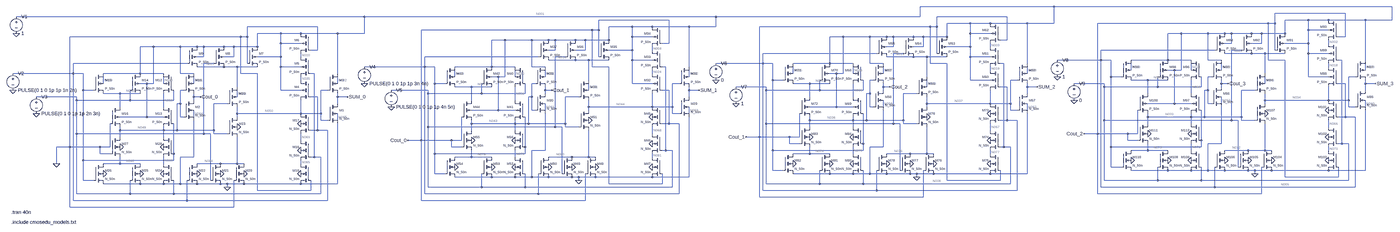
[diagram p0: schematic RIPPLE_CARRY_ADDER_50n.asc, whole sheet]
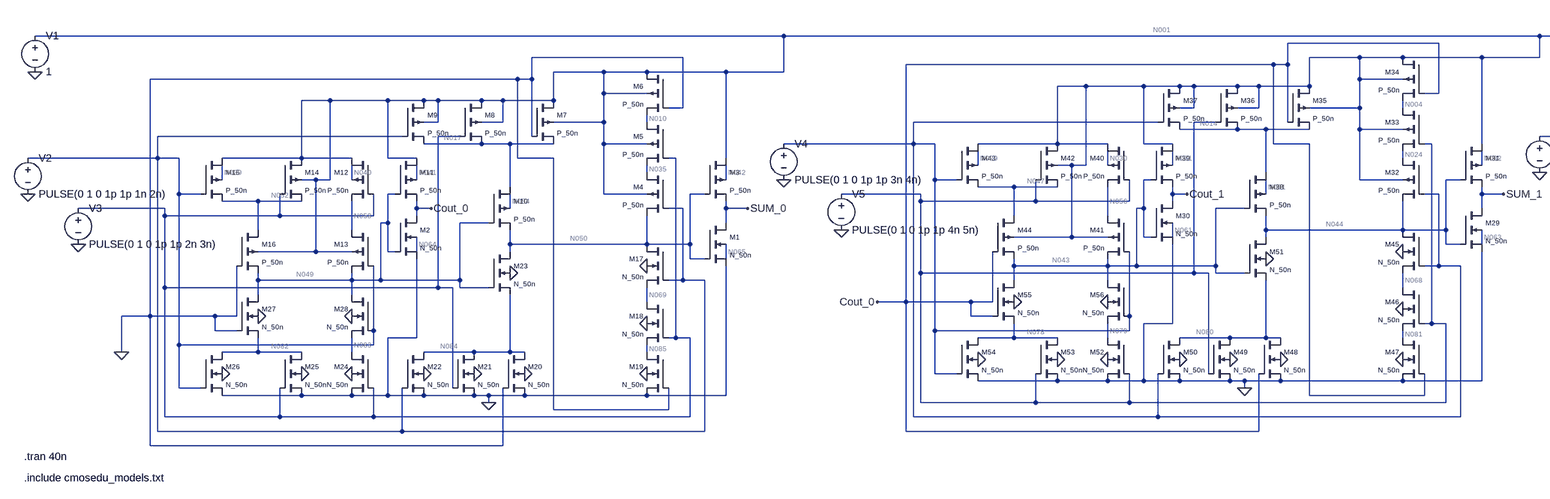
[diagram p1: schematic RIPPLE_CARRY_ADDER_50n.asc, part, row 1 of 1, column 1 of 2]
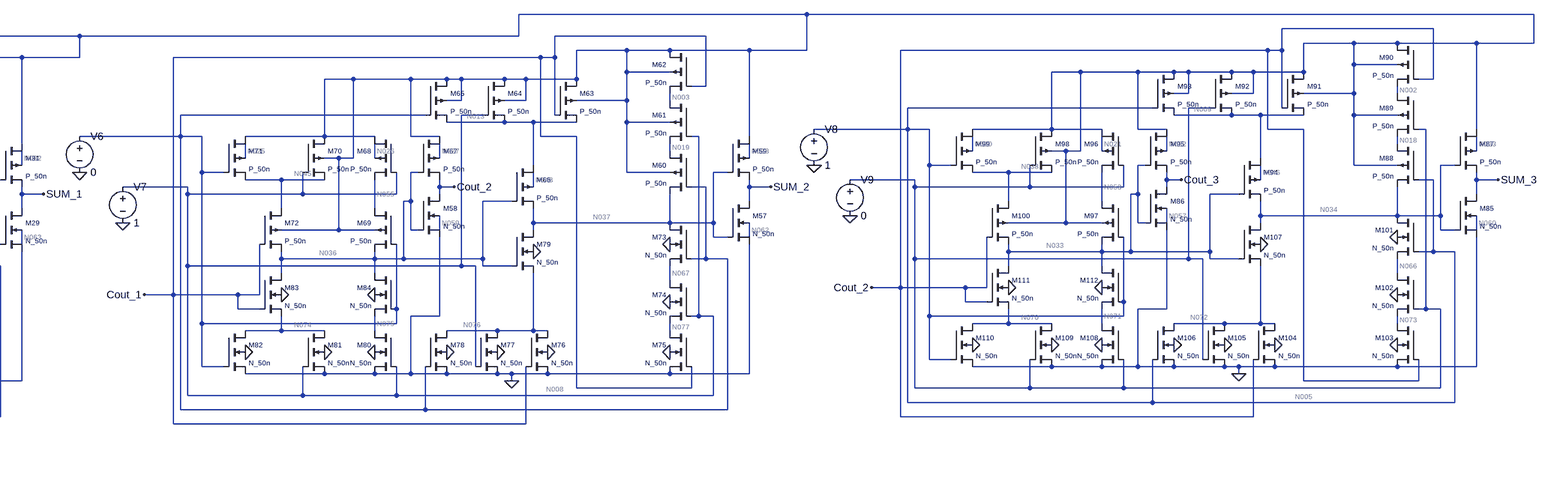
[diagram p2: schematic RIPPLE_CARRY_ADDER_50n.asc, part, row 1 of 1, column 2 of 2]
* RIPPLE_CARRY_ADDER_50n.asc
M1 SUM_0 N050 0 N065 N_50n l=50n w=2000n
M2 Cout_0 N049 0 N064 N_50n l=50n w=1000n
M3 N001 N050 SUM_0 N042 P_50n l=50n w=5000n
M4 N035 N015 N050 N001 P_50n l=50n w=1000n
M5 N010 N016 N035 N001 P_50n l=50n w=1000n
M6 N001 0 N010 N001 P_50n l=50n w=1000n
M7 N001 0 N017 N001 P_50n l=50n w=1000n
M8 N001 N016 N017 N001 P_50n l=50n w=1000n
M9 N001 N015 N017 N001 P_50n l=50n w=1000n
M10 N017 N049 N050 N054 P_50n l=50n w=1000n
M11 N001 N049 Cout_0 N041 P_50n l=50n w=1000n
M12 N001 N016 N058 N040 P_50n l=50n w=1000n
M13 N058 N015 N049 N001 P_50n l=50n w=1000n
M14 N001 N016 N052 N001 P_50n l=50n w=1000n
M15 N001 N015 N052 N039 P_50n l=50n w=1000n
M16 N052 0 N049 N001 P_50n l=50n w=1000n
M17 N050 N015 N069 0 N_50n l=50n w=500n
M18 N069 N016 N085 0 N_50n l=50n w=500n
M19 N085 0 0 0 N_50n l=50n w=500n
M20 N084 0 0 0 N_50n l=50n w=500n
M21 N084 N016 0 0 N_50n l=50n w=500n
M22 N084 N015 0 0 N_50n l=50n w=500n
M23 N050 N049 N084 0 N_50n l=50n w=500n
M24 N083 N016 0 0 N_50n l=50n w=500n
M25 N082 N016 0 0 N_50n l=50n w=500n
M26 N082 N015 0 0 N_50n l=50n w=500n
M27 N049 0 N082 0 N_50n l=50n w=500n
M28 N049 N015 N083 0 N_50n l=50n w=500n
M29 SUM_1 N044 0 N063 N_50n l=50n w=2000n
M30 Cout_1 N043 0 N061 N_50n l=50n w=1000n
M31 N001 N044 SUM_1 N032 P_50n l=50n w=5000n
M32 N024 N011 N044 N001 P_50n l=50n w=5000n
M33 N004 N012 N024 N001 P_50n l=50n w=5000n
M34 N001 Cout_0 N004 N001 P_50n l=50n w=5000n
M35 N001 Cout_0 N014 N001 P_50n l=50n w=5000n
M36 N001 N012 N014 N001 P_50n l=50n w=5000n
M37 N001 N011 N014 N001 P_50n l=50n w=5000n
M38 N014 N043 N044 N051 P_50n l=50n w=5000n
M39 N001 N043 Cout_1 N031 P_50n l=50n w=1000n
M40 N001 N012 N056 N030 P_50n l=50n w=1000n
M41 N056 N011 N043 N001 P_50n l=50n w=1000n
M42 N001 N012 N047 N001 P_50n l=50n w=1000n
M43 N001 N011 N047 N029 P_50n l=50n w=1000n
M44 N047 Cout_0 N043 N001 P_50n l=50n w=5000n
M45 N044 N011 N068 0 N_50n l=50n w=2000n
M46 N068 N012 N081 0 N_50n l=50n w=2000n
M47 N081 Cout_0 0 0 N_50n l=50n w=2000n
M48 N080 Cout_0 0 0 N_50n l=50n w=2000n
M49 N080 N012 0 0 N_50n l=50n w=2000n
M50 N080 N011 0 0 N_50n l=50n w=2000n
M51 N044 N043 N080 0 N_50n l=50n w=2000n
M52 N079 N012 0 0 N_50n l=50n w=500n
M53 N078 N012 0 0 N_50n l=50n w=500n
M54 N078 N011 0 0 N_50n l=50n w=500n
M55 N043 Cout_0 N078 0 N_50n l=50n w=2000n
M56 N043 N011 N079 0 N_50n l=50n w=500n
M57 SUM_2 N037 0 N062 N_50n l=50n w=500n
M58 Cout_2 N036 0 N059 N_50n l=50n w=1000n
M59 N001 N037 SUM_2 N028 P_50n l=50n w=1000n
M60 N019 N007 N037 N001 P_50n l=50n w=1000n
M61 N003 N008 N019 N001 P_50n l=50n w=1000n
M62 N001 Cout_1 N003 N001 P_50n l=50n w=1000n
M63 N001 Cout_1 N013 N001 P_50n l=50n w=1000n
M64 N001 N008 N013 N001 P_50n l=50n w=1000n
M65 N001 N007 N013 N001 P_50n l=50n w=1000n
M66 N013 N036 N037 N048 P_50n l=50n w=1000n
M67 N001 N036 Cout_2 N027 P_50n l=50n w=1000n
M68 N001 N008 N055 N026 P_50n l=50n w=1000n
M69 N055 N007 N036 N001 P_50n l=50n w=1000n
M70 N001 N008 N045 N001 P_50n l=50n w=1000n
M71 N001 N007 N045 N025 P_50n l=50n w=1000n
M72 N045 Cout_1 N036 N001 P_50n l=50n w=5000n
M73 N037 N007 N067 0 N_50n l=50n w=500n
M74 N067 N008 N077 0 N_50n l=50n w=500n
M75 N077 Cout_1 0 0 N_50n l=50n w=500n
M76 N076 Cout_1 0 0 N_50n l=50n w=500n
M77 N076 N008 0 0 N_50n l=50n w=500n
M78 N076 N007 0 0 N_50n l=50n w=500n
M79 N037 N036 N076 0 N_50n l=50n w=500n
M80 N075 N008 0 0 N_50n l=50n w=500n
M81 N074 N008 0 0 N_50n l=50n w=500n
M82 N074 N007 0 0 N_50n l=50n w=500n
M83 N036 Cout_1 N074 0 N_50n l=50n w=2000n
M84 N036 N007 N075 0 N_50n l=50n w=500n
M85 SUM_3 N034 0 N060 N_50n l=50n w=2000n
M86 Cout_3 N033 0 N057 N_50n l=50n w=1000n
M87 N001 N034 SUM_3 N023 P_50n l=50n w=5000n
M88 N018 N005 N034 N001 P_50n l=50n w=1000n
M89 N002 N006 N018 N001 P_50n l=50n w=1000n
M90 N001 Cout_2 N002 N001 P_50n l=50n w=1000n
M91 N001 Cout_2 N009 N001 P_50n l=50n w=1000n
M92 N001 N006 N009 N001 P_50n l=50n w=1000n
M93 N001 N005 N009 N001 P_50n l=50n w=1000n
M94 N009 N033 N034 N046 P_50n l=50n w=1000n
M95 N001 N033 Cout_3 N022 P_50n l=50n w=1000n
M96 N001 N006 N053 N021 P_50n l=50n w=1000n
M97 N053 N005 N033 N001 P_50n l=50n w=1000n
M98 N001 N006 N038 N001 P_50n l=50n w=1000n
M99 N001 N005 N038 N020 P_50n l=50n w=1000n
M100 N038 Cout_2 N033 N001 P_50n l=50n w=1000n
M101 N034 N005 N066 0 N_50n l=50n w=500n
M102 N066 N006 N073 0 N_50n l=50n w=500n
M103 N073 Cout_2 0 0 N_50n l=50n w=500n
M104 N072 Cout_2 0 0 N_50n l=50n w=500n
M105 N072 N006 0 0 N_50n l=50n w=500n
M106 N072 N005 0 0 N_50n l=50n w=500n
M107 N034 N033 N072 0 N_50n l=50n w=500n
M108 N071 N006 0 0 N_50n l=50n w=500n
M109 N070 N006 0 0 N_50n l=50n w=500n
M110 N070 N005 0 0 N_50n l=50n w=500n
M111 N033 Cout_2 N070 0 N_50n l=50n w=500n
M112 N033 N005 N071 0 N_50n l=50n w=500n
V1 N001 0 1
V2 N015 0 PULSE(0 1 0 1p 1p 1n 2n)
V3 N016 0 PULSE(0 1 0 1p 1p 2n 3n)
V4 N011 0 PULSE(0 1 0 1p 1p 3n 4n)
V5 N012 0 PULSE(0 1 0 1p 1p 4n 5n)
V6 N007 0 0
V7 N008 0 1
V8 N005 0 1
V9 N006 0 0
.model NMOS NMOS
.model PMOS PMOS
.lib standard.mos
.include cmosedu_models.txt
.tran 40n
.backanno
.end

* Results of the author's LTspice run, read from the files saved beside the schematic
* Operating Point, zero values left out:
*   V(sum_0) = 35.28 µV
*   V(n050) = 999.6 mV
*   V(n065) = 304.2 mV
*   V(cout_0) = 148.5 µV
*   V(n049) = 999.9 mV
*   V(n064) = 303.9 mV
*   V(n001) = 1 V
*   V(n042) = 797.2 mV
*   V(n035) = 999.7 mV
*   V(n010) = 999.8 mV
*   V(n017) = 1 V
*   V(n054) = 804.7 mV
*   V(n041) = 758 mV
*   V(n058) = 1 V
*   V(n040) = 675.1 mV
*   V(n052) = 1 V
*   V(n039) = 675.1 mV
*   V(n069) = 53.61 mV
*   V(n085) = 15.95 mV
*   V(n084) = 859.3 mV
*   V(n083) = 38.1 mV
*   V(n082) = 24.83 mV
*   V(sum_1) = 35.18 µV
*   V(n044) = 999.8 mV
*   V(n063) = 304.3 mV
*   V(cout_1) = 78.12 µV
*   V(n043) = 999.9 mV
*   V(n061) = 303.9 mV
*   V(n032) = 797.2 mV
*   V(n024) = 999.9 mV
*   V(n004) = 999.9 mV
*   V(n014) = 1 V
*   V(n051) = 840.5 mV
*   V(n031) = 758 mV
*   V(n056) = 999.9 mV
*   V(n030) = 675.1 mV
*   V(n047) = 999.9 mV
*   V(n029) = 675.1 mV
*   V(n068) = 53.57 mV
*   V(n081) = 15.9 mV
*   V(n080) = 859.2 mV
*   V(n079) = 38.1 mV
*   V(n078) = 54.62 mV
*   V(sum_2) = 1 V
*   V(n037) = 130.7 µV
*   V(n062) = 224.7 mV
*   V(cout_2) = 42.39 µV
*   V(n036) = 999.8 mV
*   V(n059) = 303.8 mV
*   V(n028) = 675.2 mV
*   V(n019) = 170.9 mV
*   V(n003) = 1 V
*   V(n008) = 1 V
*   V(n013) = 1 V
*   V(n048) = 757.9 mV
*   V(n027) = 758 mV
*   V(n055) = 999.8 mV
*   V(n026) = 804.8 mV
*   V(n045) = 999.8 mV
*   V(n025) = 675.1 mV
*   V(n067) = 31.45 mV
*   V(n077) = 31.45 mV
*   V(n076) = 66.24 µV
*   V(n075) = 4.058 µV
*   V(n074) = 13.76 µV
*   V(sum_3) = 1 V
*   V(n034) = 299.4 µV
*   V(n060) = 195.2 mV
*   V(cout_3) = 16.17 µV
*   V(n033) = 999.9 mV
*   V(n057) = 303.8 mV
*   V(n023) = 675.1 mV
*   V(n018) = 999.9 mV
*   V(n005) = 1 V
*   V(n002) = 1 V
*   V(n009) = 1 V
*   V(n046) = 757.9 mV
*   V(n022) = 758 mV
*   V(n053) = 1 V
*   V(n021) = 675.1 mV
*   V(n038) = 999.9 mV
*   V(n020) = 804.9 mV
*   V(n066) = 300.3 µV
*   V(n073) = 149.6 µV
*   V(n072) = 150.6 µV
*   V(n071) = 889.7 mV
*   V(n070) = 4.062 µV
*   Id(M100) = 51.55 nA
*   Ig(M100) = -17.56 nA
*   Ib(M100) = 139 pA
*   Is(M100) = -34.14 nA
*   Id(M99) = 8.865 pA
*   Is(M99) = -8.066 pA
*   Id(M98) = 68.97 nA
*   Ig(M98) = -17.56 nA
*   Ib(M98) = 139.3 pA
*   Is(M98) = -51.54 nA
*   Id(M97) = 5.38 pA
*   Is(M97) = -5.39 pA
*   Id(M96) = 17.5 nA
*   Ig(M96) = -17.49 nA
*   Is(M96) = -5.38 pA
*   Id(M95) = 20.09 nA
*   Ig(M95) = 11.13 nA
*   Is(M95) = -31.22 nA
*   Id(M94) = 20.06 nA
*   Ig(M94) = 11.12 nA
*   Is(M94) = -31.19 nA
*   Id(M93) = 1.061 pA
*   Is(M93) = -1.063 pA
*   Id(M92) = 27.46 nA
*   Ig(M92) = -17.57 nA
*   Ib(M92) = 139.3 pA
*   Is(M92) = -10.03 nA
*   Id(M91) = 27.46 nA
*   Ig(M91) = -17.56 nA
*   Ib(M91) = 139.2 pA
*   Is(M91) = -10.03 nA
*   Id(M90) = 41.55 nA
*   Ig(M90) = -17.56 nA
*   Ib(M90) = 139.2 pA
*   Is(M90) = -24.12 nA
*   Id(M89) = 24.12 nA
*   Ig(M89) = -17.56 nA
*   Ib(M89) = 139.2 pA
*   Is(M89) = -6.699 nA
*   Id(M88) = 6.699 nA
*   Ig(M88) = 11.13 nA
*   Ib(M88) = 1 pA
*   Is(M88) = -17.83 nA
*   Id(M87) = 115 nA
*   Ig(M87) = -88.05 nA
*   Is(M87) = -26.98 nA
*   Id(M72) = 151 nA
*   Ig(M72) = -88.44 nA
*   Ib(M72) = 699.1 pA
*   Is(M72) = -63.21 nA
*   Id(M71) = 168.4 nA
*   Ig(M71) = -17.48 nA
*   Is(M71) = -150.9 nA
*   Id(M70) = 8.187 pA
*   Is(M70) = -8.2 pA
*   Id(M69) = 24.13 pA
*   Ig(M69) = -17.55 nA
*   Ib(M69) = 138.8 pA
*   Is(M69) = 17.39 nA
*   Id(M68) = 24.92 pA
*   Is(M68) = -24.13 pA
*   Id(M67) = 20.13 nA
*   Ig(M67) = 11.13 nA
*   Is(M67) = -31.26 nA
*   Id(M66) = 20.11 nA
*   Ig(M66) = 11.13 nA
*   Is(M66) = -31.24 nA
*   Id(M65) = 27.48 nA
*   Ig(M65) = -17.57 nA
*   Ib(M65) = 139.3 pA
*   Is(M65) = -10.05 nA
*   Id(M64) = 1.063 pA
*   Is(M64) = -1.064 pA
*   Id(M63) = 27.48 nA
*   Ig(M63) = -17.56 nA
*   Ib(M63) = 139.1 pA
*   Is(M63) = -10.06 nA
*   Id(M62) = 22.59 nA
*   Ig(M62) = -17.56 nA
*   Ib(M62) = 139.1 pA
*   Is(M62) = -5.164 nA
*   Id(M61) = 5.164 nA
*   Ig(M61) = 5.533 nA
*   Is(M61) = -10.7 nA
*   Id(M60) = 10.7 nA
*   Ig(M60) = -40.03 pA
*   Ib(M60) = 1.836 pA
*   Is(M60) = -10.66 nA
*   Id(M59) = 24.79 nA
*   Ig(M59) = -17.48 nA
*   Is(M59) = -7.304 nA
*   Id(M44) = 92.57 nA
*   Ig(M44) = -88.46 nA
*   Ib(M44) = 699.6 pA
*   Is(M44) = -4.807 nA
*   Id(M43) = 66.44 nA
*   Ig(M43) = -17.49 nA
*   Is(M43) = -48.95 nA
*   Id(M42) = 61.05 nA
*   Ig(M42) = -17.56 nA
*   Ib(M42) = 139.3 pA
*   Is(M42) = -43.62 nA
*   Id(M41) = 32.92 nA
*   Ig(M41) = -17.56 nA
*   Ib(M41) = 139.2 pA
*   Is(M41) = -15.5 nA
*   Id(M40) = 50.41 nA
*   Ig(M40) = -17.49 nA
*   Is(M40) = -32.92 nA
*   Id(M39) = 20.06 nA
*   Ig(M39) = 11.13 nA
*   Is(M39) = -31.19 nA
*   Id(M38) = 78.94 pA
*   Is(M38) = -78.11 pA
*   Id(M37) = 87.86 nA
*   Ig(M37) = -88.54 nA
*   Ib(M37) = 702.1 pA
*   Is(M37) = -18.53 pA
*   Id(M36) = 87.86 nA
*   Ig(M36) = -88.54 nA
*   Ib(M36) = 702.1 pA
*   Is(M36) = -18.53 pA
*   Id(M35) = 87.83 nA
*   Ig(M35) = -88.49 nA
*   Ib(M35) = 700.3 pA
*   Is(M35) = -41.89 pA
*   Id(M34) = 367.3 nA
*   Ig(M34) = -88.48 nA
*   Ib(M34) = 700.3 pA
*   Is(M34) = -279.5 nA
*   Id(M33) = 279.5 nA
*   Ig(M33) = -88.5 nA
*   Ib(M33) = 701.2 pA
*   Is(M33) = -191.7 nA
*   Id(M32) = 191.7 nA
*   Ig(M32) = -88.49 nA
*   Ib(M32) = 700.5 pA
*   Is(M32) = -103.9 nA
*   Id(M31) = 84.2 nA
*   Ig(M31) = 56.11 nA
*   Is(M31) = -140.3 nA
*   Id(M16) = 29.59 nA
*   Ig(M16) = -17.56 nA
*   Ib(M16) = 139.2 pA
*   Is(M16) = -12.17 nA
*   Id(M15) = 33.42 nA
*   Ig(M15) = -17.49 nA
*   Is(M15) = -15.93 nA
*   Id(M14) = 31.09 nA
*   Ig(M14) = -17.57 nA
*   Ib(M14) = 139.3 pA
*   Is(M14) = -13.67 nA
*   Id(M13) = 23.09 nA
*   Ig(M13) = -17.56 nA
*   Ib(M13) = 139.2 pA
*   Is(M13) = -5.667 nA
*   Id(M12) = 40.58 nA
*   Ig(M12) = -17.49 nA
*   Is(M12) = -23.09 nA
*   Id(M11) = 20.04 nA
*   Ig(M11) = 11.13 nA
*   Is(M11) = -31.17 nA
*   Id(M10) = 40.83 pA
*   Is(M10) = -40.04 pA
*   Id(M9) = 17.44 nA
*   Ig(M9) = -17.57 nA
*   Ib(M9) = 139.3 pA
*   Is(M9) = -13.61 pA
*   Id(M8) = 17.44 nA
*   Ig(M8) = -17.57 nA
*   Ib(M8) = 139.3 pA
*   Is(M8) = -13.61 pA
*   Id(M7) = 17.44 nA
*   Ig(M7) = -17.57 nA
*   Ib(M7) = 139.3 pA
*   Is(M7) = -13.61 pA
*   Id(M6) = 125.1 nA
*   Ig(M6) = -17.56 nA
*   Ib(M6) = 139.3 pA
*   Is(M6) = -107.7 nA
*   Id(M5) = 107.7 nA
*   Ig(M5) = -17.55 nA
*   Ib(M5) = 139 pA
*   Is(M5) = -90.29 nA
*   Id(M4) = 90.29 nA
*   Ig(M4) = -17.54 nA
*   Ib(M4) = 138.7 pA
*   Is(M4) = -72.89 nA
*   Id(M3) = 84.65 nA
*   Ig(M3) = 56.06 nA
*   Is(M3) = -140.7 nA
*   Id(M112) = 3.129 nA
*   Ib(M112) = -1.891 pA
*   Is(M112) = -3.128 nA
*   Id(M111) = 3.646 nA
*   Ig(M111) = -620.4 pA
*   Ib(M111) = -1 pA
*   Is(M111) = -3.025 nA
*   Id(M110) = 3.024 nA
*   Ig(M110) = 1.747 nA
*   Ib(M110) = -32.94 pA
*   Is(M110) = -4.738 nA
*   Id(M108) = 3.128 nA
*   Ig(M108) = -358.8 pA
*   Is(M108) = -2.768 nA
*   Id(M107) = 141.3 nA
*   Ig(M107) = 1.744 nA
*   Ib(M107) = -32.78 pA
*   Is(M107) = -143 nA
*   Id(M106) = 143 nA
*   Ig(M106) = 1.746 nA
*   Ib(M106) = -32.94 pA
*   Is(M106) = -144.7 nA
*   Id(M105) = 5.552 pA
*   Is(M105) = -5.552 pA
*   Id(M104) = 5.559 pA
*   Is(M104) = -5.559 pA
*   Id(M103) = 5.525 pA
*   Is(M103) = -5.525 pA
*   Id(M102) = 5.526 pA
*   Is(M102) = -5.525 pA
*   Id(M101) = -1.706 nA
*   Ig(M101) = 1.744 nA
*   Ib(M101) = -32.79 pA
*   Is(M101) = -5.526 pA
*   Id(M86) = 31.22 nA
*   Ig(M86) = 3.364 nA
*   Is(M86) = -34.58 nA
*   Id(M85) = 26.98 nA
*   Ig(M85) = -2.518 nA
*   Is(M85) = -24.46 nA
*   Id(M84) = 3.642 nA
*   Ig(M84) = -620.3 pA
*   Ib(M84) = -1 pA
*   Is(M84) = -3.021 nA
*   Id(M83) = 14.81 nA
*   Ig(M83) = -2.518 nA
*   Ib(M83) = -1.001 pA
*   Is(M83) = -12.29 nA
*   Id(M81) = 12.29 nA
*   Ig(M81) = 1.747 nA
*   Ib(M81) = -32.94 pA
*   Is(M81) = -14.01 nA
*   Id(M80) = 3.021 nA
*   Ig(M80) = 1.747 nA
*   Ib(M80) = -32.94 pA
*   Is(M80) = -4.734 nA
*   Id(M79) = 60.73 nA
*   Ig(M79) = 1.744 nA
*   Ib(M79) = -32.78 pA
*   Is(M79) = -62.44 nA
*   Id(M78) = 2.446 pA
*   Is(M78) = -2.445 pA
*   Id(M77) = 62.44 nA
*   Ig(M77) = 1.747 nA
*   Ib(M77) = -32.94 pA
*   Is(M77) = -64.15 nA
*   Id(M76) = 2.451 pA
*   Is(M76) = -2.451 pA
*   Id(M75) = 738 pA
*   Is(M75) = -737.9 pA
*   Id(M74) = -731.4 pA
*   Ig(M74) = 1.49 nA
*   Ib(M74) = -20.53 pA
*   Is(M74) = -738 pA
*   Id(M73) = -731.3 pA
*   Is(M73) = 731.4 pA
*   Id(M58) = 84.56 nA
*   Ig(M58) = 3.362 nA
*   Is(M58) = -87.92 nA
*   Id(M57) = 7.304 nA
*   Ig(M57) = -620.5 pA
*   Is(M57) = -6.684 nA
*   Id(M56) = 1.431 nA
*   Ig(M56) = -620.8 pA
*   Ib(M56) = -1.038 pA
*   Is(M56) = -809.1 pA
*   Id(M55) = 4.375 nA
*   Ig(M55) = -2.52 nA
*   Ib(M55) = -1.055 pA
*   Is(M55) = -1.854 nA
*   Id(M54) = 927 pA
*   Is(M54) = -926.8 pA
*   Id(M53) = 927 pA
*   Is(M53) = -926.8 pA
*   Id(M52) = 809.1 pA
*   Is(M52) = -808.9 pA
*   Id(M51) = 36.69 nA
*   Ig(M51) = 2.373 pA
*   Ib(M51) = -1.866 pA
*   Is(M51) = -36.69 nA
*   Id(M50) = 12.21 nA
*   Ig(M50) = -1.246 nA
*   Is(M50) = -10.97 nA
*   Id(M49) = 12.21 nA
*   Ig(M49) = -1.246 nA
*   Is(M49) = -10.97 nA
*   Id(M48) = 12.26 nA
*   Ig(M48) = -1.245 nA
*   Is(M48) = -11.01 nA
*   Id(M47) = 1.914 nA
*   Is(M47) = -1.914 nA
*   Id(M46) = 1.915 nA
*   Is(M46) = -1.914 nA
*   Id(M45) = 4.436 nA
*   Ig(M45) = -2.52 nA
*   Ib(M45) = -1.054 pA
*   Is(M45) = -1.915 nA
*   Id(M30) = 157.3 nA
*   Ig(M30) = 3.365 nA
*   Is(M30) = -160.6 nA
*   Id(M29) = 140.3 nA
*   Ig(M29) = 6.76 nA
*   Is(M29) = -147.1 nA
*   Id(M28) = 1.431 nA
*   Ig(M28) = -620.9 pA
*   Ib(M28) = -1.038 pA
*   Is(M28) = -809.1 pA
*   Id(M27) = 1.905 nA
*   Ig(M27) = -620.9 pA
*   Ib(M27) = -1.025 pA
*   Is(M27) = -1.283 nA
*   Id(M26) = 641.6 pA
*   Is(M26) = -641.5 pA
*   Id(M25) = 641.6 pA
*   Is(M25) = -641.5 pA
*   Id(M24) = 809.1 pA
*   Is(M24) = -808.9 pA
*   Id(M23) = 9.023 nA
*   Ib(M23) = -1.861 pA
*   Is(M23) = -9.022 nA
*   Id(M22) = 3.007 nA
*   Ig(M22) = -306.9 pA
*   Is(M22) = -2.699 nA
*   Id(M21) = 3.007 nA
*   Ig(M21) = -306.9 pA
*   Is(M21) = -2.699 nA
*   Id(M20) = 3.007 nA
*   Ig(M20) = -306.9 pA
*   Is(M20) = -2.699 nA
*   Id(M19) = 470.3 pA
*   Is(M19) = -470.2 pA
*   Id(M18) = 470.6 pA
*   Is(M18) = -470.3 pA
*   Id(M17) = 1.092 nA
*   Ig(M17) = -620 pA
*   Ib(M17) = -1.053 pA
*   Is(M17) = -470.6 pA
*   Id(M2) = 300.4 nA
*   Ig(M2) = 3.365 nA
*   Is(M2) = -303.7 nA
*   Id(M1) = 140.7 nA
*   Ig(M1) = 6.753 nA
*   Is(M1) = -147.5 nA
*   I(V9) = 70.54 nA
*   I(V8) = -16.37 nA
*   I(V7) = -12.26 nA
*   I(V6) = 53.26 nA
*   I(V5) = 213.3 nA
*   I(V4) = 216.5 nA
*   I(V3) = 70.48 nA
*   I(V2) = 71.71 nA
*   I(V1) = -1.918 µA